# EAGLE schematic RoverMuxJig (EAGLE 7.1.0)
DATABASE: /home/mes/eagle/PARTSDB.txt
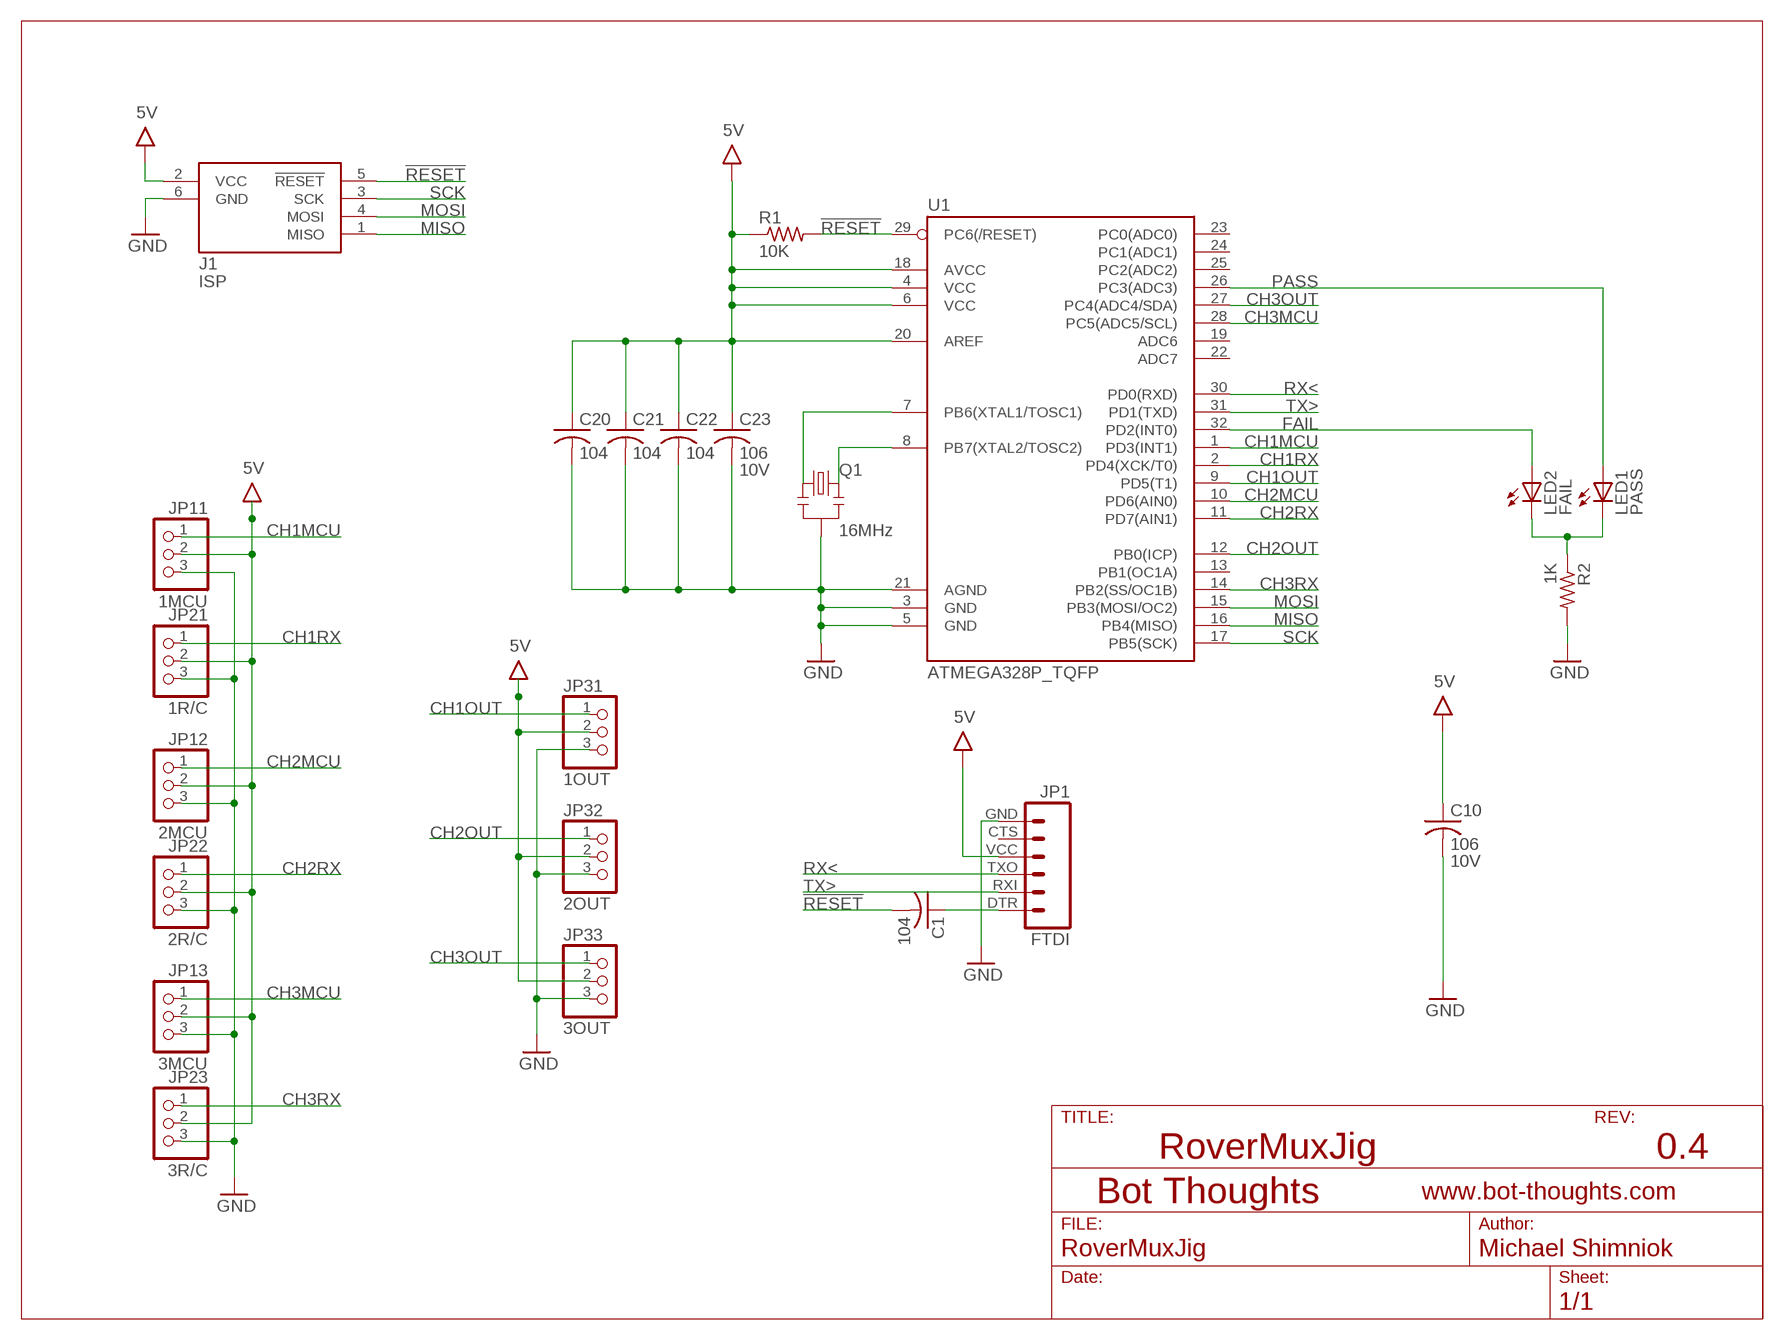
[diagram p0: schematic, sheet 1]

## Parts
C1  104  C-USC0603  [C0603]
C10  106  C-USC0603  [C0603]
C20  104  C-USC0603  [C0603]
C21  104  C-USC0603  [C0603]
C22  104  C-USC0603  [C0603]
C23  106  C-USC0603  [C0603]
J1  ISP  AVRISP6  [CON6P2R]
JP1  FTDI  FTDI_BASICPTH  [FTDI_BASIC]
JP11  1MCU  PINHD-1X03_2.54-S  [1X03-S]
JP12  2MCU  PINHD-1X03_2.54-S  [1X03-S]
JP13  3MCU  PINHD-1X03_2.54-S  [1X03-S]
JP21  1R/C  PINHD-1X03_2.54-S  [1X03-S]
JP22  2R/C  PINHD-1X03_2.54-S  [1X03-S]
JP23  3R/C  PINHD-1X03_2.54-S  [1X03-S]
JP31  1OUT  PINHD-1X03_2.54-S  [1X03-S]
JP32  2OUT  PINHD-1X03_2.54-S  [1X03-S]
JP33  3OUT  PINHD-1X03_2.54-S  [1X03-S]
LED1  PASS  LEDCHIPLED_1206  [CHIPLED_1206]
LED2  FAIL  LEDCHIPLED_1206  [CHIPLED_1206]
Q1  16MHz  RESONATOR_CSTCE_V_C  [CSTCE_V_C]
R1  10K  R-US_R0603  [R0603]
R2  1K  R-US_R0603  [R0603]
U1  ATMEGA328P_TQFP  [TQFP32-08]

## Nets
5V: C10.1 C20.1 C21.1 C22.1 C23.1 J1.2(VCC) JP1.VCC JP11.2 JP12.2 JP13.2 JP21.2 JP22.2 JP23.2 JP31.2 JP32.2 JP33.2 R1.1 U1.4(VCC) U1.6(VCC) U1.18(AVCC) U1.20(AREF)
!RESET: C1.2 J1.5(!RESET) R1.2 U1.29(PC6(/RESET))
CH1MCU: JP11.1 U1.1(PD3(INT1))
CH1OUT: JP31.1 U1.9(PD5(T1))
CH1RX: JP21.1 U1.2(PD4(XCK/T0))
CH2MCU: JP12.1 U1.10(PD6(AIN0))
CH2OUT: JP32.1 U1.12(PB0(ICP))
CH2RX: JP22.1 U1.11(PD7(AIN1))
CH3MCU: JP13.1 U1.28(PC5(ADC5/SCL))
CH3OUT: JP33.1 U1.27(PC4(ADC4/SDA))
CH3RX: JP23.1 U1.14(PB2(SS/OC1B))
FAIL: LED2.A U1.32(PD2(INT0))
GND: C10.2 C20.2 C21.2 C22.2 C23.2 J1.6(GND) JP1.GND JP11.3 JP12.3 JP13.3 JP21.3 JP22.3 JP23.3 JP31.3 JP32.3 JP33.3 Q1.GND R2.2 U1.3(GND) U1.5(GND) U1.21(AGND)
MISO: J1.1(MISO) U1.16(PB4(MISO))
MOSI: J1.4(MOSI) U1.15(PB3(MOSI/OC2))
N$1: Q1.X2 U1.8(PB7(XTAL2/TOSC2))
N$2: Q1.X1 U1.7(PB6(XTAL1/TOSC1))
N$3: LED1.C LED2.C R2.1
N$4: C1.1 JP1.DTR
PASS: LED1.A U1.26(PC3(ADC3))
RX<: JP1.TXO U1.30(PD0(RXD))
SCK: J1.3(SCK) U1.17(PB5(SCK))
TX>: JP1.RXI U1.31(PD1(TXD))
Unconnected: JP1.CTS U1.13(PB1(OC1A)) U1.19(ADC6) U1.22(ADC7) U1.23(PC0(ADC0)) U1.24(PC1(ADC1)) U1.25(PC2(ADC2))

## Notes on the sheet
- RoverMuxJig | 0.4

## Library data of the parts
C1 C20-C22 = rcl:C-US: CAPACITOR, American symbol; PARTNO: C1608X7R1E104K080AA
C10 C23 = rcl:C-US: CAPACITOR, American symbol; PARTNO: CL10A106MP8NNNC; VOLTAGE: 10V
J1 = bt_avr:AVRISP6: 6-pin dual-row connector for Atmel AVRISP programmer interface
JP1 = SparkFun-Connectors:FTDI_BASIC: FTDI Basic header with labels
JP11-JP13 JP21-JP23 JP31-JP33 = pinhead-2:PINHD-1X03: PIN HEADER
LED1 = led:LED: LED OSRAM: - CHIPLED LG R971, LG N971, LY N971, LG Q971, LY Q971, LO R971, LY R971 LH N974, LH R974 LS Q976, LO Q976, LY Q976 LO Q996 - Hyper CHIPLED LW Q18S LB Q993, LB Q99A, LB R99A - SideLED LS A670, LO A670, LY A670, LG A670, LP A670 LB A673, LV A673, LT A673, LW A673 LH A674 LY A675 LS A676, LA A676, LO A676, LY A676, LW A676 LS A679, LY A679, LG A679 - Hyper Micro SIDELED® LS Y876, LA Y876, LO Y876, LY Y876 LT Y87S - SmartLED LW L88C, LW L88S LB L89C, LB L89S, LG L890 LS L89K, LO L89K, LY L89K LS L896, LA L896, LO L896, LY L896 - TOPLED LS T670, LO T670, LY T670, LG T670, LP T670 LSG T670, LSP T670, LSY T670, LOP T670, LYG T670 LG T671, LOG T671, LSG T671 LB T673, LV T673, LT T673, LW T673 LH T674 LS T676, LA T676, LO T676, LY T676, LB T676, LH T676, LSB T676, LW T676 LB T67C, LV T67C, LT T67C, LS T67K, LO T67K, LY T67K, LW E67C LS E67B, LA E67B, LO E67B, LY E67B, LB E67C, LV E67C, LT E67C LW T67C LS T679, LY T679, LG T679 LS T770, LO T770, LY T770, LG T770, LP T770 LB T773, LV T773, LT T773, LW T773 LH T774 LS E675, LA E675, LY E675, LS T675 LS T776, LA T776, LO T776, LY T776, LB T776 LHGB T686 LT T68C, LB T68C - Hyper Mini TOPLED® LB M676 - Mini TOPLED Santana® LG M470 LS M47K, LO M47K, LY M47K Source: http://www.osram.convergy.de LUXEON: - LUMILED® LXK2-PW12-R00, LXK2-PW12-S00, LXK2-PW14-U00, LXK2-PW14-V00 LXK2-PM12-R00, LXK2-PM12-S00, LXK2-PM14-U00 LXK2-PE12-Q00, LXK2-PE12-R00, LXK2-PE12-S00, LXK2-PE14-T00, LXK2-PE14-U00 LXK2-PB12-K00, LXK2-PB12-L00, LXK2-PB12-M00, LXK2-PB14-N00, LXK2-PB14-P00, LXK2-PB14-Q00 LXK2-PR12-L00, LXK2-PR12-M00, LXK2-PR14-Q00, LXK2-PR14-R00 LXK2-PD12-Q00, LXK2-PD12-R00, LXK2-PD12-S00 LXK2-PH12-R00, LXK2-PH12-S00 LXK2-PL12-P00, LXK2-PL12-Q00, LXK2-PL12-R00 Source: www.luxeon.com KINGBRIGHT: KA-3528ASYC Source: www.kingbright.com; PARTNO: LH N974-KN-1
LED2 = led:LED: LED OSRAM: - CHIPLED LG R971, LG N971, LY N971, LG Q971, LY Q971, LO R971, LY R971 LH N974, LH R974 LS Q976, LO Q976, LY Q976 LO Q996 - Hyper CHIPLED LW Q18S LB Q993, LB Q99A, LB R99A - SideLED LS A670, LO A670, LY A670, LG A670, LP A670 LB A673, LV A673, LT A673, LW A673 LH A674 LY A675 LS A676, LA A676, LO A676, LY A676, LW A676 LS A679, LY A679, LG A679 - Hyper Micro SIDELED® LS Y876, LA Y876, LO Y876, LY Y876 LT Y87S - SmartLED LW L88C, LW L88S LB L89C, LB L89S, LG L890 LS L89K, LO L89K, LY L89K LS L896, LA L896, LO L896, LY L896 - TOPLED LS T670, LO T670, LY T670, LG T670, LP T670 LSG T670, LSP T670, LSY T670, LOP T670, LYG T670 LG T671, LOG T671, LSG T671 LB T673, LV T673, LT T673, LW T673 LH T674 LS T676, LA T676, LO T676, LY T676, LB T676, LH T676, LSB T676, LW T676 LB T67C, LV T67C, LT T67C, LS T67K, LO T67K, LY T67K, LW E67C LS E67B, LA E67B, LO E67B, LY E67B, LB E67C, LV E67C, LT E67C LW T67C LS T679, LY T679, LG T679 LS T770, LO T770, LY T770, LG T770, LP T770 LB T773, LV T773, LT T773, LW T773 LH T774 LS E675, LA E675, LY E675, LS T675 LS T776, LA T776, LO T776, LY T776, LB T776 LHGB T686 LT T68C, LB T68C - Hyper Mini TOPLED® LB M676 - Mini TOPLED Santana® LG M470 LS M47K, LO M47K, LY M47K Source: http://www.osram.convergy.de LUXEON: - LUMILED® LXK2-PW12-R00, LXK2-PW12-S00, LXK2-PW14-U00, LXK2-PW14-V00 LXK2-PM12-R00, LXK2-PM12-S00, LXK2-PM14-U00 LXK2-PE12-Q00, LXK2-PE12-R00, LXK2-PE12-S00, LXK2-PE14-T00, LXK2-PE14-U00 LXK2-PB12-K00, LXK2-PB12-L00, LXK2-PB12-M00, LXK2-PB14-N00, LXK2-PB14-P00, LXK2-PB14-Q00 LXK2-PR12-L00, LXK2-PR12-M00, LXK2-PR14-Q00, LXK2-PR14-R00 LXK2-PD12-Q00, LXK2-PD12-R00, LXK2-PD12-S00 LXK2-PH12-R00, LXK2-PH12-S00 LXK2-PL12-P00, LXK2-PL12-Q00, LXK2-PL12-R00 Source: www.luxeon.com KINGBRIGHT: KA-3528ASYC Source: www.kingbright.com; PARTNO: LG N971-KN-1
Q1 = bt_crystal:RESONATOR: Crystal Resonator, 3-pin
R1 R2 = rcl:R-US_: RESISTOR, American symbol; PARTNO: RC0603JR-07330RL
U1 = SparkFun-DigitalIC:ATMEGA328P_TQFP; PROD_ID: IC-09069